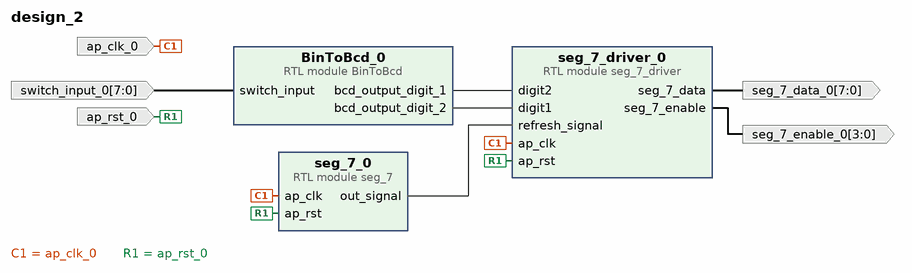
[diagram p0: block diagram of the top level]
# Vivado block design design_2, xc7a100tcsg324-1, Vivado 2022.2
create_bd_design design_2

create_bd_port -dir I -from 7 -to 0 switch_input_0
create_bd_port -dir O -from 7 -to 0 seg_7_data_0
create_bd_port -dir O -from 3 -to 0 seg_7_enable_0
create_bd_port -dir I -type clk ap_clk_0
create_bd_port -dir I -type rst ap_rst_0

create_bd_cell -type module -reference seg_7_driver seg_7_driver_0
create_bd_cell -type module -reference BinToBcd BinToBcd_0
create_bd_cell -type module -reference seg_7 seg_7_0

# ---- connections ----

connect_bd_net [get_bd_pins BinToBcd_0/bcd_output_digit_1] [get_bd_pins seg_7_driver_0/digit2]
connect_bd_net [get_bd_pins BinToBcd_0/bcd_output_digit_2] [get_bd_pins seg_7_driver_0/digit1]
connect_bd_net -net ap_clk_0_1 [get_bd_ports ap_clk_0] [get_bd_pins seg_7_driver_0/ap_clk] [get_bd_pins seg_7_0/ap_clk]
connect_bd_net -net ap_rst_0_1 [get_bd_ports ap_rst_0] [get_bd_pins seg_7_driver_0/ap_rst] [get_bd_pins seg_7_0/ap_rst]
connect_bd_net [get_bd_pins seg_7_0/out_signal] [get_bd_pins seg_7_driver_0/refresh_signal]
connect_bd_net [get_bd_pins seg_7_driver_0/seg_7_data] [get_bd_ports seg_7_data_0]
connect_bd_net [get_bd_pins seg_7_driver_0/seg_7_enable] [get_bd_ports seg_7_enable_0]
connect_bd_net -net switch_input_0_1 [get_bd_ports switch_input_0] [get_bd_pins BinToBcd_0/switch_input]

validate_bd_design
save_bd_design
